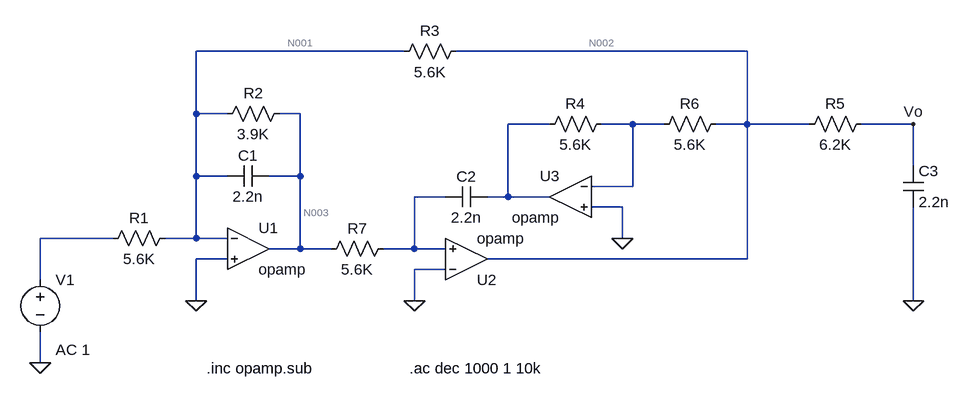
[diagram p0: schematic circuito.asc]
circuito.asc, the LTspice schematic file:
Version 4.1
SHEET 1 1088 680
WIRE 240 -128 -80 -128
WIRE 768 -128 320 -128
WIRE -80 -32 -80 -128
WIRE -32 -32 -80 -32
WIRE 80 -32 48 -32
WIRE 464 -16 400 -16
WIRE 592 -16 544 -16
WIRE 640 -16 592 -16
WIRE 768 -16 768 -128
WIRE 768 -16 720 -16
WIRE 864 -16 768 -16
WIRE 1024 -16 944 -16
WIRE 1024 48 1024 -16
WIRE -80 64 -80 -32
WIRE -32 64 -80 64
WIRE 80 64 80 -32
WIRE 80 64 32 64
WIRE 592 80 592 -16
WIRE 592 80 528 80
WIRE 304 96 256 96
WIRE 400 96 400 -16
WIRE 400 96 368 96
WIRE 464 96 400 96
WIRE 576 112 528 112
WIRE -208 160 -320 160
WIRE -80 160 -80 64
WIRE -80 160 -128 160
WIRE -32 160 -80 160
WIRE 576 160 576 112
WIRE 80 176 80 64
WIRE 80 176 32 176
WIRE 128 176 80 176
WIRE 256 176 256 96
WIRE 256 176 208 176
WIRE 304 176 256 176
WIRE -32 192 -80 192
WIRE 768 192 768 -16
WIRE 768 192 368 192
WIRE 304 208 256 208
WIRE -320 224 -320 160
WIRE -80 256 -80 192
WIRE 256 256 256 208
WIRE 1024 256 1024 112
WIRE -320 352 -320 304
FLAG -80 256 0
FLAG 256 256 0
FLAG 576 160 0
FLAG 1024 256 0
FLAG -320 352 0
FLAG 1024 -16 Vo
SYMBOL res -112 144 R90
WINDOW 0 0 56 VBottom 2
WINDOW 3 32 56 VTop 2
SYMATTR InstName R1
SYMATTR Value 5.6K
SYMBOL res 64 -48 R90
WINDOW 0 0 56 VBottom 2
WINDOW 3 32 56 VTop 2
SYMATTR InstName R2
SYMATTR Value 3.9K
SYMBOL res 336 -144 R90
WINDOW 0 0 56 VBottom 2
WINDOW 3 32 56 VTop 2
SYMATTR InstName R3
SYMATTR Value 5.6K
SYMBOL res 560 -32 R90
WINDOW 0 0 56 VBottom 2
WINDOW 3 32 56 VTop 2
SYMATTR InstName R4
SYMATTR Value 5.6K
SYMBOL res 736 -32 R90
WINDOW 0 0 56 VBottom 2
WINDOW 3 32 56 VTop 2
SYMATTR InstName R6
SYMATTR Value 5.6K
SYMBOL res 224 160 R90
WINDOW 0 0 56 VBottom 2
WINDOW 3 32 56 VTop 2
SYMATTR InstName R7
SYMATTR Value 5.6K
SYMBOL res 960 -32 R90
WINDOW 0 0 56 VBottom 2
WINDOW 3 32 56 VTop 2
SYMATTR InstName R5
SYMATTR Value 6.2K
SYMBOL cap 32 48 R90
WINDOW 0 0 32 VBottom 2
WINDOW 3 32 32 VTop 2
SYMATTR InstName C1
SYMATTR Value 2.2n
SYMBOL OpAmps\\opamp 0 112 R0
SYMATTR InstName U1
SYMBOL OpAmps\\opamp 336 256 M180
SYMATTR InstName U2
SYMBOL OpAmps\\opamp 496 32 M0
SYMATTR InstName U3
SYMBOL cap 368 80 R90
WINDOW 0 0 32 VBottom 2
WINDOW 3 32 32 VTop 2
SYMATTR InstName C2
SYMATTR Value 2.2n
SYMBOL cap 1008 48 R0
SYMATTR InstName C3
SYMATTR Value 2.2n
SYMBOL voltage -320 208 R0
WINDOW 123 24 124 Left 2
WINDOW 39 0 0 Left 0
SYMATTR InstName V1
SYMATTR Value ""
SYMATTR Value2 AC 1
TEXT -64 360 Left 2 !.inc opamp.sub
TEXT 248 360 Left 2 !.ac dec 1000 1 10k

The netlist it stands for:
* circuito.asc
R1 N001 N007 5.6K
R2 N003 N001 3.9K
R3 N002 N001 5.6K
R4 N005 N004 5.6K
R6 N002 N005 5.6K
R7 N006 N003 5.6K
R5 Vo N002 6.2K
C1 N003 N001 2.2n
X§U1 N001 0 N003 opamp Aol=100K GBW=10Meg  ; pins invin noninvin out
X§U2 0 N006 N002 opamp Aol=100K GBW=10Meg  ; pins invin noninvin out
X§U3 N005 0 N004 opamp Aol=100K GBW=10Meg  ; pins invin noninvin out
C2 N004 N006 2.2n
C3 Vo 0 2.2n
V1 N007 0 AC 1
.inc opamp.sub
.ac dec 1000 1 10k
.backanno
.end

* Results of the author's LTspice run, read from the files saved beside the schematic
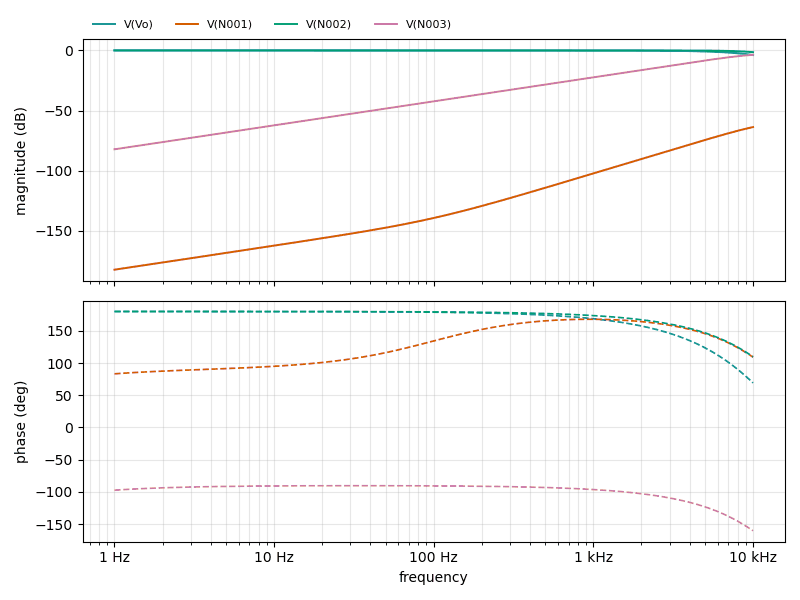
[diagram p1: AC Analysis of circuito.asc, plotted from the saved traces]
* AC Analysis, 1 run:
*   V(Vo): -0.00 dB at 1 Hz, -3.85 dB at 10 kHz, peak -0.00 dB at 1 Hz, 3 dB below the peak at 8.943 kHz
*   V(N001): -182.14 dB at 1 Hz, -63.67 dB at 10 kHz, peak -63.67 dB at 10 kHz, 3 dB below the peak at 8.053 kHz
*   V(N002): -0.00 dB at 1 Hz, -1.45 dB at 10 kHz, peak -0.00 dB at 1 Hz
*   V(N003): -82.14 dB at 1 Hz, -3.67 dB at 10 kHz, peak -3.67 dB at 10 kHz, 3 dB below the peak at 6.177 kHz